# EAGLE design OneDollarBoard.com.1.004.r1 (EAGLE 9.7.0)
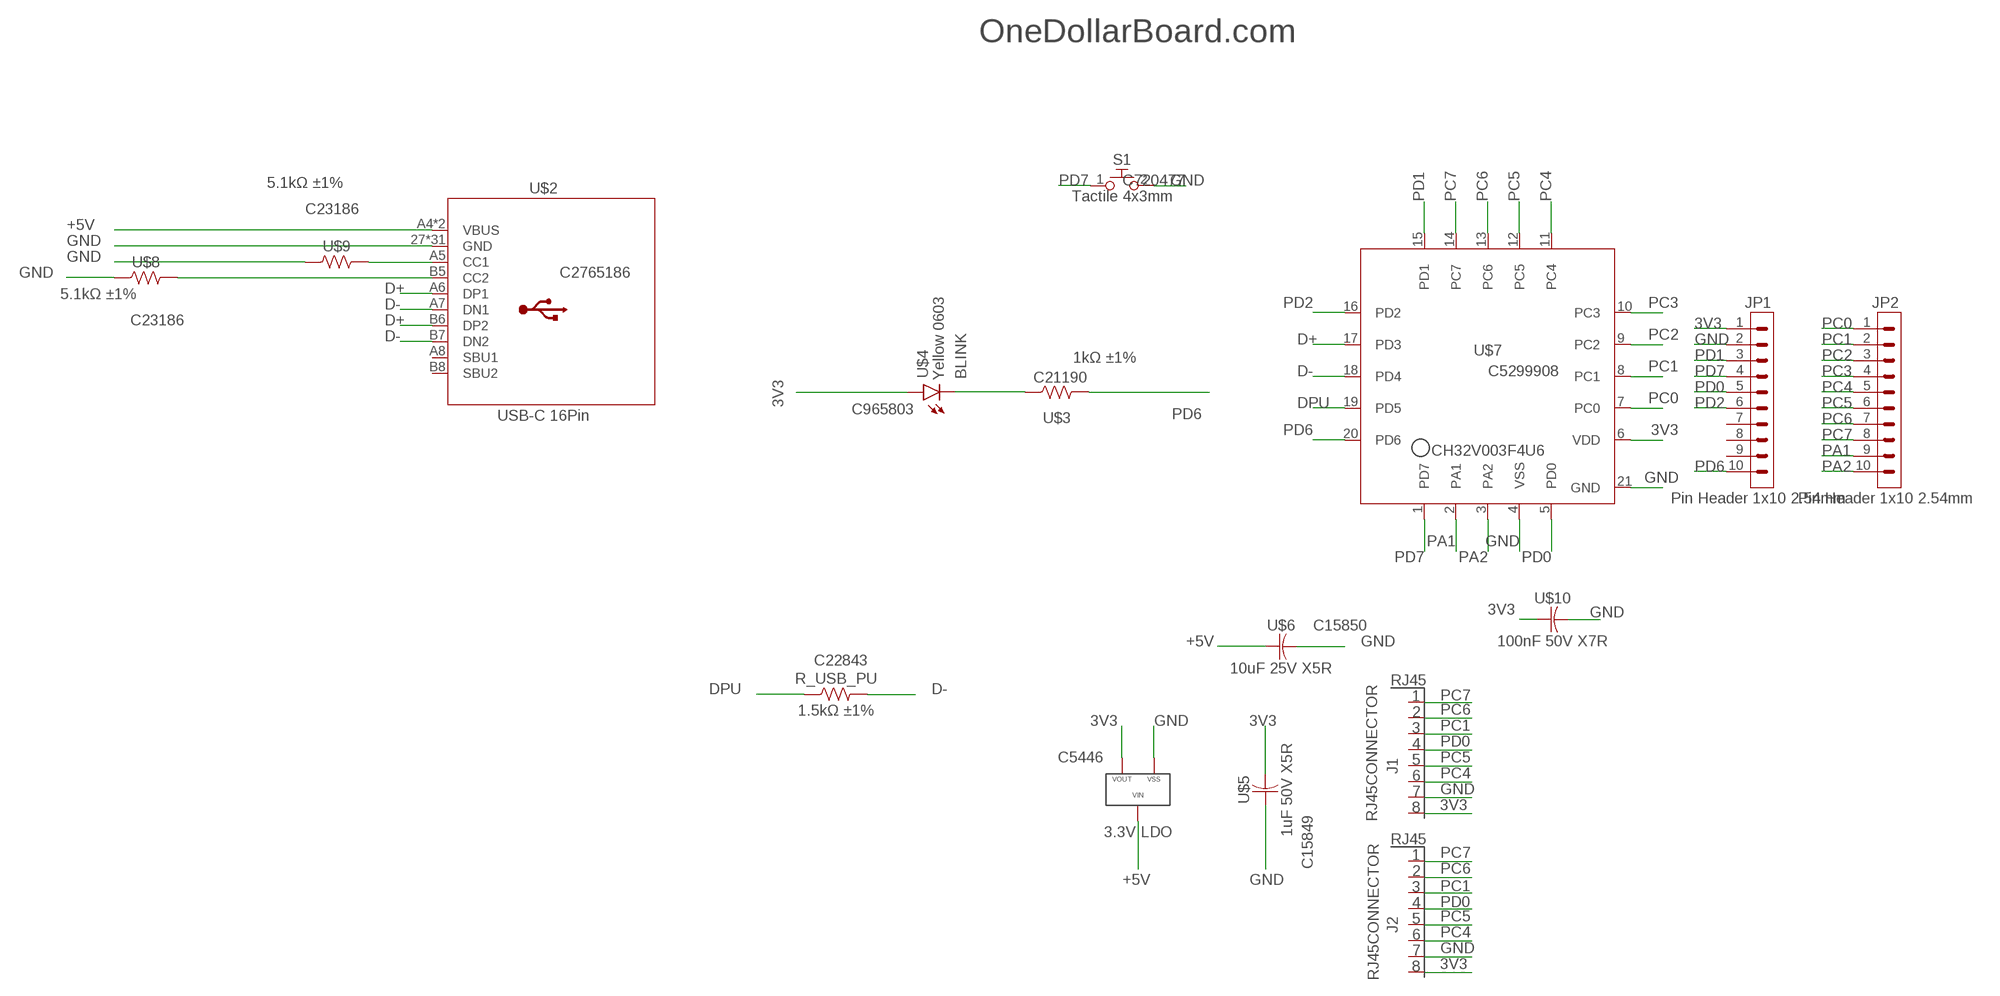
[diagram p0: schematic, sheet 1]

## Parts
J1  RJ45CONNECTOR  [2.54/1.0]
J2  RJ45CONNECTOR  [2.54/1.0]
JP1  Pin Header 1x10 2.54mm  PINHD-1X10  [1X10]
JP2  Pin Header 1x10 2.54mm  PINHD-1X10  [1X10]
R_USB_PU  1.5kΩ ±1%  R_0603_1.5K  [WRIS-RSKS_0603_WAVE]
S1  Tactile 4x3mm  B3U-X000B3U-1000P(M)1000P(M)  [B3U-1000P(M)]
U$1  3.3V LDO  XC6206P332MR-G  [XC6206P332MR-G]
U$2  USB-C 16Pin  USB-C  [CONN_TYPE-C-16P]
U$3  1kΩ ±1%  R_0603_1K_1%_0.1W_C21190  [RESC2208X45]
U$4  Yellow 0603  LED  [LEDC1507X40]
U$5  1uF 50V X5R  CAP1UF  [CPA1UF]
U$6  10uF 25V X5R  CAP10UF  [CAP0603]
U$7  CH32V003F4U6  CH32V003  [CH32V003F4U6]
U$8  5.1kΩ ±1%  R_0603_5.1KRES_0603  [WRIS-RSKS_0603_REFLOW]
U$9  5.1kΩ ±1%  R_0603_5.1KRES_0603  [WRIS-RSKS_0603_REFLOW]
U$10  100nF 50V X7R  CAP100NF  [CAP0603]

## Nets
3V3: J1.P$1(P1) J2.P$1(P1) JP1.1 U$1.2 U$4.A U$5.2 U$7.6(VDD) U$10.1
+5V: U$1.3 U$2.A4(VBUS) U$2.B4(VBUS) U$6.1
BLINK: U$3.1 U$4.C
D+: U$2.A6(DP1) U$2.B6(DP2) U$7.17(PD3)
D-: R_USB_PU.2 U$2.A7(DN1) U$2.B7(DN2) U$7.18(PD4)
DPU: R_USB_PU.1 U$7.19(PD5)
GND: J1.P$2(P2) J2.P$2(P2) JP1.2 S1.2 U$1.1 U$2.27(GND) U$2.28(GND) U$2.29(GND) U$2.30(GND) U$2.A1(GND) U$2.B1(GND) U$2.S_1(GND) U$2.S_1_H1(GND) U$2.S_1_H2(GND) U$2.S_2(GND) U$2.S_2_H1(GND) U$2.S_2_H2(GND) U$2.S_2_H3(GND) U$2.S_2_H4(GND) U$2.S_2_H5(GND) U$2.S_2_H6(GND) U$2.S_2_H7(GND) U$2.S_2_H12(GND) U$2.S_2_H13(GND) U$2.S_3(GND) U$2.S_3_H1(GND) U$2.S_3_H2(GND) U$2.S_3_H3(GND) U$2.S_3_H4(GND) U$2.S_3_H5(GND) U$2.S_4(GND) U$2.S_4_H1(GND) U$2.S_4_H2(GND) U$2.S_4_H3(GND) U$2.S_4_H4(GND) U$2.S_4_H5(GND) U$5.1 U$6.2 U$7.4(VSS) U$7.21(GND) U$8.1 U$9.1 U$10.2
N$1: U$2.A5(CC1) U$9.2
N$2: U$2.B5(CC2) U$8.2
PA1: JP2.9 U$7.2(PA1)
PA2: JP2.10 U$7.3(PA2)
PC0: JP2.1 U$7.7(PC0)
PC1: J1.P$6(P6) J2.P$6(P6) JP2.2 U$7.8(PC1)
PC2: JP2.3 U$7.9(PC2)
PC3: JP2.4 U$7.10(PC3)
PC4: J1.P$3(P3) J2.P$3(P3) JP2.5 U$7.11(PC4)
PC5: J1.P$4(P4) J2.P$4(P4) JP2.6 U$7.12(PC5)
PC6: J1.P$7(P7) J2.P$7(P7) JP2.7 U$7.13(PC6)
PC7: J1.P$8(P8) J2.P$8(P8) JP2.8 U$7.14(PC7)
PD0: J1.P$5(P5) J2.P$5(P5) JP1.5 U$7.5(PD0)
PD1: JP1.3 U$7.15(PD1)
PD2: JP1.6 U$7.16(PD2)
PD6: JP1.10 U$3.2 U$7.20(PD6)
PD7: JP1.4 S1.1 U$7.1(PD7)
Unconnected: JP1.7 JP1.8 JP1.9 U$2.A8(SBU1) U$2.B8(SBU2)

## Notes on the sheet
- OneDollarBoard.com

## Library data of the parts
J1 J2 = odb.1.004:RJ45CONNECTOR: Through-Hole Pad; CATEGORY: Connectors; DESCRIPTION: Pad with 2.54 mm diamater and 1mm drill; PACKAGE_SIZE: NA; PACKAGE_TYPE: Through Hole; PITCH: NA
JP1 JP2 = odb.1.004:PINHD-1X10: 8 C350306; CATEGORY: Connector, Pin Header; DATASHEET: https://www.lcsc.com/datasheet/C350306.pdf; DESCRIPTION: Header-Straight-10 Position; IPN: 8; LCSC: C350306; LCSC_PART: C350306; MANUFACTURER: HOAUC; MFR_PART: 2685Y-110CNG1SNA01; ODB_REV: 1.004.R1; PACKAGE: TH_1X10_2.54MM; PACKAGE_TYPE: Through Hole; PITCH: 0.100" (2.54mm); SUBCATEGORY: Headers; TYPE: Male Pins
R_USB_PU = odb.1.004:R_0603_1.5K: 9 C22843; CATEGORY: Resistor; DATASHEET: https://www.lcsc.com/datasheet/C22843.pdf; IPN: 9; LCSC: C22843; LCSC_PART: C22843; MANUFACTURER: UNI-ROYAL; MFR_PART: 0603WAF1501T5E; ODB_REV: 1.004; PACKAGE: 0603
S1 = odb.1.004:B3U-X000: Ultra-small Tactile Switch Contact form : SPST-NO Reference: Datasheet <https://omronfs.omron.com/en_US/ecb/products/pdf/en-b3u.pdf>; CATEGORY: Switch; DATASHEET: https://www.lcsc.com/datasheet/C720477.pdf; DESCRIPTION: Tactile Switch SPST-NO Top Actuated Surface Mount; LCSC: C720477; LCSC_PART: C720477; MANUFACTURER: XUNPU; MFR_PART: TS-1088-AR02016; MPN: B3U-1000PM; ODB_REV: 1.004; OPERATING_TEMPERATURE: -25°C ~ 70°C; PACKAGE: SMD; PACKAGE_SIZE: NA; PACKAGE_TYPE: SMD; PART_STATUS: ACTIVE; ROHS: COMPLIANT; SERIES: B3U; SUBCATEGORY: Tactile Switches; TYPE: SPST-NO
U$1 = odb.1.004:XC6206P332MR-G: 12 C5446; CATEGORY: Voltage Regulator; DATASHEET: https://www.lcsc.com/datasheet/C5446.pdf; IPN: 12; LCSC: C5446; LCSC_PART: C5446; MANUFACTURER: TOREX; MFR_PART: XC6206P332MR-G; ODB_REV: 1.004; PACKAGE: SOT-23-3
U$2 = odb.1.004:USB-C: 11 C2765186; CATEGORY: Connector; DATASHEET: https://www.lcsc.com/datasheet/C2765186.pdf; IPN: 11; LCSC: C2765186; LCSC_PART: C2765186; MANUFACTURER: SHOU HAN; MFR_PART: TYPE-C_16PIN_2MD(073); ODB_REV: 1.004; PACKAGE: SMD
U$3 = odb.1.004:R_0603_1K_1%_0.1W_C21190: 10 C21190; CATEGORY: Resistor; DATASHEET: https://www.lcsc.com/datasheet/C21190.pdf; IPN: 10; LCSC: C21190; LCSC_PART: C21190; MANUFACTURER: UNI-ROYAL; MFR_PART: 0603WAF1001T5E; ODB_REV: 1.004; PACKAGE: 0603
U$4 = odb.1.004:LED: IPN: 7 LCSC: C965803; CATEGORY: LED; DATASHEET: https://www.lcsc.com/datasheet/C965803.pdf; IPN: 7; LCSC: C965803; LCSC_PART: C965803; MANUFACTURER: XINGLIGHT; MFR_PART: XL-1608UYC-04; ODB_REV: 1.004; PACKAGE: 0603
U$5 = odb.1.004:CAP1UF: 5 C15849; CATEGORY: Capacitor; DATASHEET: https://www.lcsc.com/datasheet/C15849.pdf; IPN: 5; LCSC: C15849; LCSC_PART: C15849; MANUFACTURER: Samsung Electro-Mechanics; MFR_PART: CL10A105KB8NNNC; ODB_REV: 1.004; PACKAGE: 0603
U$6 = odb.1.004:CAP10UF: 4 C15850; CATEGORY: Capacitor; DATASHEET: https://www.lcsc.com/datasheet/C15850.pdf; IPN: 4; LCSC: C15850; LCSC_PART: C15850; MANUFACTURER: Samsung Electro-Mechanics; MFR_PART: CL21A106KAYNNNE; ODB_REV: 1.004; PACKAGE: 0805
U$7 = odb.1.004:CH32V003: 6 C5299908; CATEGORY: MCU; DATASHEET: https://www.lcsc.com/datasheet/C5299908.pdf; IPN: 6; LCSC: C5299908; LCSC_PART: C5299908; MANUFACTURER: WCH; MFR_PART: CH32V003F4U6; ODB_REV: 1.004; PACKAGE: QFN20 3x3mm
U$8 U$9 = odb.1.004:R_0603_5.1K: Resistor 5.1kΩ ±1% 100mW; CATEGORY: Resistor; DATASHEET: https://www.lcsc.com/datasheet/C23186.pdf; LCSC: C23186; LCSC_PART: C23186; MANUFACTURER: UNI-ROYAL; MFR_PART: 0603WAF5101T5E; ODB_REV: 1.004; PACKAGE: 0603
U$10 = odb.1.004:CAP100NF: 3 C30926; CATEGORY: Capacitor; DATASHEET: https://www.lcsc.com/datasheet/C30926.pdf; IPN: 3; LCSC_PART: C30926; MANUFACTURER: FH; MFR_PART: 0603B104K500NT; ODB_REV: 1.004; PACKAGE: 0603

## Board
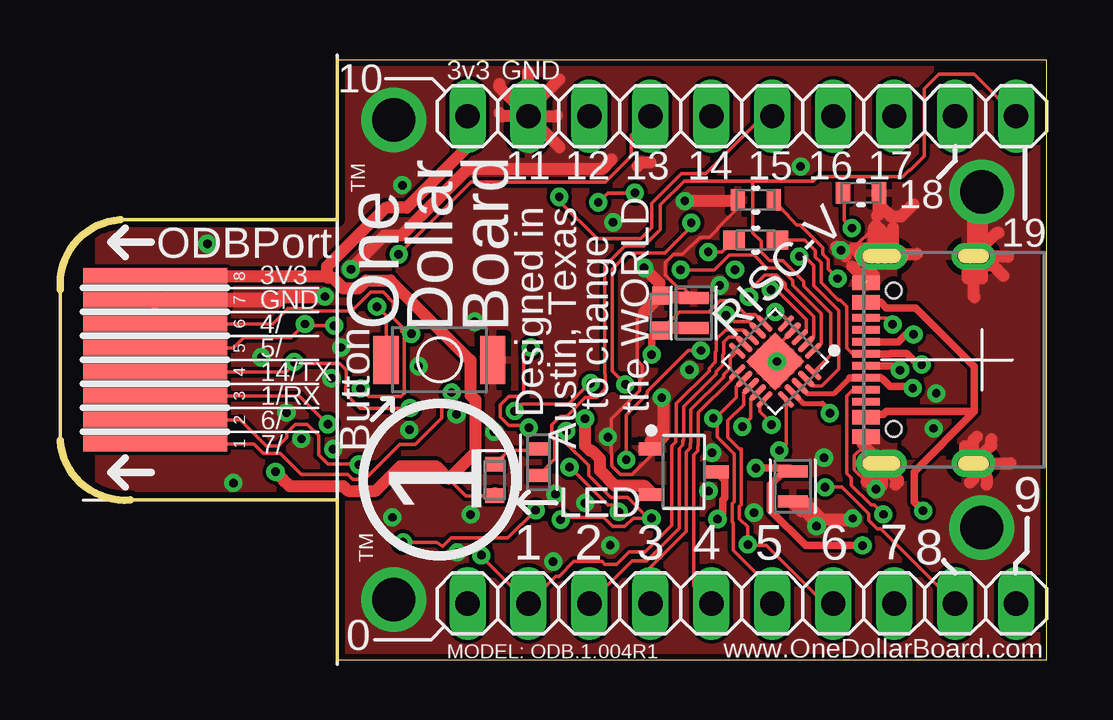
[diagram p1: board, top side]
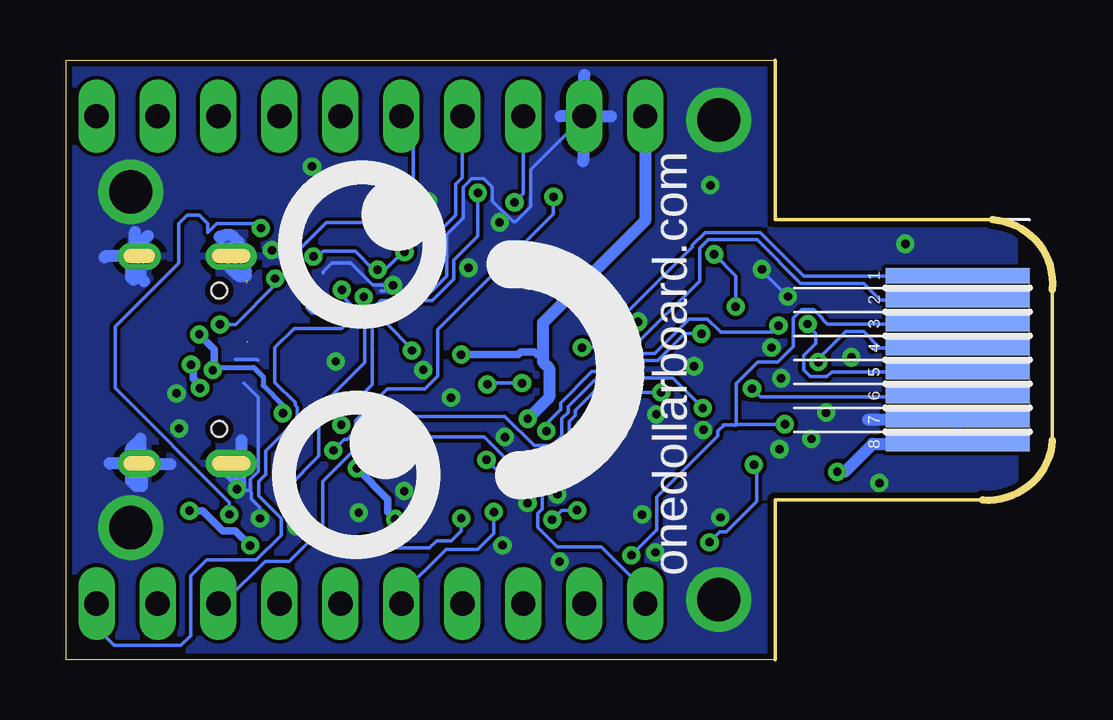
[diagram p2: board, bottom side, seen from below]

Size 41.11 x 25 mm. Coordinates in mm from the lower left corner, seen from the top.
Outline: 11.56,0 41.11,0 41.11,25 11.56,25 11.56,18.34 2.5,18.34 arc91 0.01,15.44 0.01,9.14 arc91 2.92,6.66 11.56,6.66 11.56,0
Copper layers (1*16): Top 0.035mm / dielectric 1.5mm / Bottom 0.035mm
Design rules "Fusion Electronics Design Rules *": minimum track width 6mil, minimum drill 0.35mm, track to track 6mil, track to pad 6mil, pad to pad 6mil, via to via 6mil, smd to smd 6mil, copper to edge 0.25mm, drill to drill 6mil, minimum pad ring 10mil, minimum via ring 8mil, stop-mask expansion 4mil, vias tented up to drill 0.5mm, thermal gap 10mil

### Footprints (pad centres in the part's own frame; a part is rotated, then mirrored left to right if it is on the bottom)
2.54/1.0 = smd 6 x 0.635: P$1 0,-3.5; P$2 0,-2.5; P$3 0,-1.5; P$4 0,-0.5; P$5 0,0.5; P$6 0,1.5; P$7 0,2.5; P$8 0,3.5
1X10 = drill 1.016 long: 1 -11.43,0; 2 -8.89,0; 3 -6.35,0; 4 -3.81,0; 5 -1.27,0; 6 1.27,0; 7 3.81,0; 8 6.35,0; 9 8.89,0; 10 11.43,0
WRIS-RSKS_0603_WAVE = smd 0.9 x 0.8: 1 -0.9,0; 2 0.9,0
B3U-1000P(M) = smd 1.05 x 2: 1 -2.225,0; 2 2.225,0
XC6206P332MR-G = smd 1.032 x 0.537: 1 -1.35,0.95; 2 -1.35,-0.95; 3 1.35,0
CONN_TYPE-C-16P = smd 1.016 x 2.1: 27 -4.32,4.18; 28 4.32,4.18; S_2 -4.32,4.18 | smd 1.016 x 1.8: 29 -4.32,0.35; 30 4.32,0.35; S_3 4.32,0.35; S_4 -4.32,0.35 | smd 0.6 x 1.14: A1 -3.2,4.826; A4 -2.4,4.826; B1 3.2,4.826; B4 2.4,4.826 | smd 0.3 x 1.14: A5 -1.25,4.826; A6 -0.25,4.826; A7 0.25,4.826; B7 -0.75,4.826; B8 -1.75,4.826 | smd 0.305 x 1.14: A8 1.25,4.826; B5 1.75,4.826; B6 0.75,4.826 | smd 1.016 x 2.2: S_1 4.32,4.18 | drill 0.6 pad 0.6: S_1_H1 -4.32,3.686; S_1_H2 -4.32,4.68; S_2_H1 4.32,3.68; S_2_H2 4.32,4.68; S_2_H3 -4.32,3.88; S_2_H4 -4.32,4.38; S_2_H5 4.32,4.18; S_2_H6 -4.32,3.68; S_2_H7 -4.32,4.08; S_2_H12 4.32,3.88; S_2_H13 4.32,4.48; S_3_H1 -4.32,0.7; S_3_H2 -4.32,0; S_3_H3 -4.32,0.4; S_3_H4 -4.32,0.2; S_3_H5 -4.32,0.6; S_4_H1 4.32,0.7; S_4_H2 4.32,0; S_4_H3 4.32,0.4; S_4_H4 4.32,0.2; S_4_H5 4.32,0.6 | hole 0.65: -2.89,3.68; 2.89,3.68
RESC2208X45 = smd 0.55 x 0.9: 1 -0.55,0; 2 0.55,0
LEDC1507X40 = smd 0.61 x 0.8: A 0.655,0; C -0.655,0
CPA1UF = smd 0.75 x 0.7: 1 -0.725,0; 2 0.725,0
CAP0603 = smd 0.5 x 1.25: 1 -0.625,0; 2 0.625,0
CH32V003F4U6 = smd 0.862 x 0.224: 1 -1.435,0.8; 2 -1.435,0.4; 3 -1.435,0; 4 -1.435,-0.4; 5 -1.435,-0.8; 11 1.435,-0.8; 12 1.435,-0.4; 13 1.435,0; 14 1.435,0.4; 15 1.435,0.8 | smd 0.224 x 0.862: 6 -0.8,-1.435; 7 -0.4,-1.435; 8 0,-1.435; 9 0.4,-1.435; 10 0.8,-1.435; 16 0.8,1.435; 17 0.4,1.435; 18 0,1.435; 19 -0.4,1.435; 20 -0.8,1.435 | smd 1.7 x 1.7: 21 0,0
WRIS-RSKS_0603_REFLOW = smd 0.6 x 0.9: 1 -0.75,0; 2 0.75,0

### Placement (x,y rotation side)
J1  3.96,12.5 180 top
J2  3.96,12.5 0 bottom
JP1  28.41,22.66 0 top
JP2  28.41,2.34 0 top
R_USB_PU  28.99,17.5 0 top
S1  15.81,12.5 0 top
U$1  25.99,7.83 0 top
U$2  38.41,12.5 90 top
U$3  19.94,8.23 270 top
U$4  18.12,7.49 270 top
U$5  25.02,14.45 270 top
U$6  30.53,7.23 270 top
U$7  29.8,12.43 225 top
U$8  28.99,19.17 0 top
U$9  33.37,19.46 180 top
U$10  26.41,14.45 90 top

### Tracks (layer width: path | path; a pad name or v marks a point on that pad's centre or on a via)
3V3  (via drill 0.35)
  Top 0.152: 4.31,16 4.46,15.95 4.41,16 J1.P$1 | U$5.2 25.06,13.72 25.16,13.82 | U$1.2 24.6,7.01 | U$5.2 24.9,13.72 | JP1.1 16.98,21.82 | U$4.A 16.9,6.83 16.2,7.54 | U$5.2 25.79,14.5 27.04,14.5 27.5,14.96 28.01,14.96 28.58,14.4 28.97,14.4 U$7.6 | 26.73,13.72 26.52,13.72 U$10.1
  Top 0.305: 11.12,15.96 11.13,15.95 | 24.9,13.72 24.65,13.47 v24.65,12.72 | 9.23,7.58 9.27,7.54 | 22.15,8.72 22.08,8.72 | 21.78,10.08 21.84,10.08 v21.87,10.04
  Top 0.508: 4.31,16 11.08,16 11.13,15.95 11.16,15.92 11.36,15.92 11.79,15.49 12.44,15.49 12.76,15.81 13.77,15.81 17.1,12.47 17.1,11.03 17.31,10.83 17.31,8.64 16.2,7.54 16.19,7.54 15.65,8.07 14.2,8.07 13.17,7.04 12,7.04 11.8,7.24 9.57,7.24 9.27,7.54 | JP1.1 16.98,21.93 | v8.98,7.83 9.23,7.58 | 22.15,8.72 22.5,8.36 22.5,7.88 23.14,7.24 24.37,7.24 24.6,7.01 | 18.12,6.93 U$4.A | 21.78,10.08 21.78,9.96 21.88,9.86 21.88,8.92 22.08,8.72 | 16.98,21.82 16.98,21.39 14.44,18.85 13.58,18.85 11.12,16.39 11.12,15.96 | U$10.1 25.16,13.82
  Bottom 0.152: JP1.1 16.98,22.56 | v8.98,7.83 8.67,7.83
  Bottom 0.305: 21.25,12.72 21.48,12.72 21.6,12.83 22.16,12.83 22.28,12.72 v24.65,12.72
  Bottom 0.508: 16.98,22.56 16.98,18.3 21.25,14.04 21.25,12.72 21.25,12.42 20.98,12.15 20.98,10.93 v21.87,10.04 | 8.67,7.83 7.5,9 J2.P$1
+5V  (via drill 0.35)
  Top 0.152: U$2.A4 33.59,10.21 | 34.08,14.9 U$2.B4
  Top 0.305: 38.09,10.34 34.43,10.34 34.3,10.21 33.59,10.21 | 38.09,10.34 38.09,12.22 35.65,14.66 35.36,14.66 34.43,14.66 34.19,14.9 34.08,14.9 | v35.97,6.2 35.59,6.58 35.59,7.84 38.09,10.34 | v29,7.99 30.4,7.99 U$6.1 30.17,7.86 29.6,7.28 29.6,6.23 31.07,4.76 v33.44,4.76 | U$1.3 27.7,7.47 27.7,6.74 27.62,6.67 27.62,6.08 v27.4,5.86
  Bottom 0.305: v33.44,4.76 34.06,5.37 34.59,5.37 35.42,6.2 v35.97,6.2 | v29,7.99 27.7,6.69 27.7,6.16 v27.4,5.86
BLINK
  Top 0.152: U$3.1 19.91,8.73 | 19.91,8.73 19.88,8.69 | U$4.C 18.71,8.73 19.91,8.73
D+  (via drill 0.35)  (1 unrouted)
  Top 0.152: U$7.17 30.53,11.12 | 31.77,10.68 31.78,10.67
  Top 0.203: 31.77,10.68 30.97,10.68 30.53,11.12 | 31.78,10.67 32.08,10.37 v32.08,10.27
  Top 0.305: U$2.A6 34.7,12.25 34.88,12.07 v35,12.07 | v35.56,13.56 35.24,13.56 34.93,13.25 33.55,13.25
  Bottom 0.152: 34.88,12.19 34.93,12.14 | v32.08,10.27 32.08,10.37
  Bottom 0.203: 34.88,12.19 33.3,12.19 32.9,11.79 32.9,11.42 32.08,10.6 32.08,10.37
  Bottom 0.305: v35,12.07 34.93,12.14 34.93,12.93 v35.56,13.56
D-  (via drill 0.35)
  Top 0.152: 33.64,11.69 U$2.B7 33.59,11.74 34.05,11.74 34.19,11.77 | 29.83,17.52 R_USB_PU.2 31.03,17.5 31.48,17.05 31.48,16.79 31.71,16.55 31.71,15.72 32.43,15 32.51,15 32.78,14.72 32.78,13 33.04,12.75 33.81,12.75
  Top 0.2: 31.12,11.11 U$7.18
  Top 0.203: 31.12,11.11 31.15,11.09 32.24,11.09 32.9,11.75
  Top 0.305: 34.19,11.77 34.25,11.71 34.28,11.71 34.6,11.38 35.47,11.38 v35.53,11.32 | U$2.A7 33.81,12.75 34.59,12.75 34.59,12.76 35.28,12.76 35.74,12.3 v35.91,12.3 | U$2.B7 32.9,11.75
  Bottom 0.305: v35.53,11.32 35.53,11.44 35.8,11.72 35.8,12.2 v35.91,12.3
DPU  (via drill 0.35)
  Top 0.152: U$7.19 31.38,11.41 31.75,11.41 32.45,12.11 32.45,14.55 31.4,15.6 31.4,16.43 31.07,16.76 30.86,16.76 v30.81,16.81 | R_USB_PU.1 27.76,17.17 27.75,17.17 27.58,17 v27.01,17
  Bottom 0.152: 30.87,16.97 30.71,16.82 30.71,16.72 30.4,17.03 29.06,17.03 28.28,16.25 v28.13,16.25 | v27.01,17 27.09,17 27.94,16.14 28.05,16.25 v28.13,16.25 | v28.13,16.26 v28.13,16.25 | 30.87,16.97 30.87,17.08 30.85,17.1 | 30.87,16.97 30.87,16.88 v30.81,16.81
GND  (via drill 0.35, 1.8, 1.8 pad 0.1)  (1 unrouted)
  Top 0.152: 25.06,15.09 U$5.1 | 26.53,14.94 U$10.2 26,15.49 25.77,15.49 25.22,16.03 25.22,16.55 25.58,16.9 25.95,16.9 26.66,17.61 27.06,17.61 27.41,17.96 27.41,17.99 28.16,18.74 U$8.1 | 34.05,18.5 34.05,18.14 34.01,18.1 33.91,18 33.06,17.15 32.98,17.07 | 33.44,9 33.44,8.84 33.1,8.51 33.1,7.92 33.6,7.43 33.97,7.05 34.04,7.05 34.04,7.06 v33.99,7.11 | 32.34,17.03 32.34,17.21 | 24.34,14.49 24.04,14.2 24.04,12.47 24.25,12.26 24.25,11.76 24.16,11.66 24.16,11.22 22.97,10.03 22.97,8.59 22.99,8.57 22.99,8.08 23.34,7.72 23.84,7.72 24.62,8.5 24.62,8.78 | 31.41,5.83 32.66,5.83 | J1.P$2 4.59,15 | v29.87,12.43 30.49,12.43 30.59,12.53 | 30.6,12.53 30.59,12.53 | 33.38,16.02 33.38,15.92 33.58,15.72 U$2.B1 | 33.61,16.02 33.58,15.99 U$2.B1 | U$2.B1 33.9,16.02 | 27.19,15.61 27.52,15.28 27.52,15.27 | U$7.21 29.9,12.53 | 29.9,12.53 30.59,12.53 | U$7.4 29.9,13.1 29.9,12.53
  Top 0.508: JP1.2 18.45,22.66 18.31,22.8 | JP1.2 19.51,24.5 | JP1.2 20.67,22.66 20.71,22.7 | JP1.2 20.61,21.57 | JP1.2 18.31,23.87 18.31,24 | JP1.2 19.52,22.91 20.81,24.2 | U$2.A1 33.58,9.14 | 33.58,9.14 33.44,9 | 34.04,7.05 34.23,7.24 U$2.27 | U$2.27 34.23,8.06 33.6,7.43 | U$2.27 33.58,8.83 33.58,9.14 | 33.91,16.02 33.9,16.02 33.61,16.02 | U$2.S_2_H5 34.33,16.92 | 34.33,16.92 35.7,16.92 | 32.73,16.82 32.34,17.21 32.4,17.21 v32.54,17.07 | 24.62,8.78 24.62,9.16 25.04,9.58 25.04,9.18 U$1.1 25.17,9.31 25.17,10.83 v25.07,10.93 | U$10.2 26.39,15.09 25.06,15.09 | 24.34,14.49 U$5.1 24.98,15.22 24.98,15.7 v24.34,16.34 | JP1.2 20.82,21.36 | JP1.2 19.52,21.45 19.61,21.36 | 31.41,5.83 31.04,6.2 | 31.11,6.5 31.11,6.26 31.04,6.2 | U$6.2 31,6.61 31.11,6.5 | 31.11,6.5 31.77,5.83 32.66,5.83 32.7,5.79 32.93,5.79 v33.03,5.89 | U$2.30 38.06,18.35 38.11,18.4 38.41,18.1 38.41,17.62 | U$2.30 37.81,16.57 37.81,15.9 | U$2.30 38.41,16.47 38.41,15.9 | U$2.30 38.06,15.15 38.11,15.1 | U$2.S_2_H5 33.39,16.82 33.06,17.15 34.1,17.15 34.33,16.92 | U$2.S_2_H5 33.91,17.14 33.91,18 | U$2.29 38.81,8.93 38.81,9.2 | U$2.29 37.71,8.53 37.71,8.9 | U$2.29 38.06,9.15 38.21,9.3 | U$2.29 38.06,7.53 37.91,7.38 | U$2.29 38.61,7.63 38.61,7.3 | U$2.29 39.59,8.18 39.61,8.2 | U$2.27 34.91,7.5 34.91,7.4 34.81,7.3 | U$2.30 39.49,16.82 39.51,16.8 | U$2.S_2_H5 34.71,17.3 34.71,18 | U$2.S_2_H5 34.23,17.88 34.01,18.1 | 39.31,16 38.86,16.45 38.43,16.45 U$2.30 | U$2.30 39.04,17.8 39.11,17.8 | 34.05,18.5 34.12,18.57 U$9.1 34.17,19.41 34.17,18.95 34.63,18.49 35.06,18.49 35.56,18.99 | 33,16.4 33.38,16.02 | U$8.1 28.11,19.12 v26.03,19.12 | 22.98,20.85 22.59,20.46 16.99,20.46 14.21,17.68 13.52,17.68 v12.12,16.28
  Top 0.508: 24.6,20.73 24.22,20.73 24.06,20.57 | 31.04,6.2 30.87,6.2 30.49,6.58
  Top 0.61: 4.59,15 9.1,15 9.27,15.17 10.99,15.17 11.02,15.14 v11.04,15.14
  Bottom 0.152: 33.44,7.01 33.48,7.05 33.88,7.05 34.05,7.05 | 7.7,10 7.72,9.98 7.78,9.98 | 33.44,7.01 33.44,7.52 33.1,7.85 33.1,10.92 33.71,11.53 | J2.P$2 6.14,10 | JP1.2 21.75,20.43 21.75,18.88 22.38,18.26 22.48,18.26 23.35,19.12 23.35,19.71 23.7,20.07 24.21,20.07 24.56,19.71 24.56,18.41 25.25,17.72 25.25,16 25.86,15.4 27.8,15.4 | 33.11,12.49 33.14,12.49 33.16,12.52 34.07,12.52 | 27.8,15.4 27.83,15.4 27.85,15.38 28,15.38 | 27.8,15.4 27.59,15.61 27.19,15.61 | 31.83,16.21 31.83,16.37 v32.54,17.07 | 30.39,16.11 30.39,16.18 30.04,16.52 29.25,16.52 28.34,15.61 v27.49,15.61 | 33.61,16.2 33.61,15.82 | 33.44,7.01 33.39,6.97 33.39,6.71 33.03,6.34 v33.03,5.89 | v11.04,15.14 12.12,16.22 v12.12,16.28
  Bottom 0.305: JP1.2 19.57,22.61 | 18.4,22.66 18.37,22.69 | 19.52,24.38 19.55,24.41 | 20.52,22.66 20.54,22.64
  Bottom 0.508: 19.57,22.61 19.57,20.77 | JP1.2 18.4,22.66 | JP1.2 19.52,24.38 | JP1.2 20.52,22.66 | 34.37,17.18 U$2.S_2_H1 33.91,16 33.61,16 | 33.61,16.2 U$2.S_2_H5 | U$2.S_2_H6 34.05,7.5 34.05,7.05 v33.99,7.11 | U$2.S_2_H7 33.88,7.73 33.88,7.05 | U$2.S_2_H4 33.8,8.41 33.8,9.16 | U$2.S_3_H2 39.29,8.18 39.3,8.19 | 36.77,8.15 37.98,8.15 U$2.S_3_H3 38,9.21 38.41,8.8 U$2.S_3_H2 | U$2.S_3_H4 37.94,7.91 37.94,7.24 38.19,7.24 38.41,7.46 U$2.S_3_H2 | U$2.S_4_H2 38.24,16.99 38.24,17.83 | U$2.S_4_H2 38.41,15.94 38.31,15.84 | U$2.S_4_H2 39.48,16.82 39.52,16.78 | 37.7,17.68 38.01,17.37 U$2.S_4_H3 38.01,15.92 37.87,15.78 | U$2.S_2_H13 33.93,17.42 34.21,17.7 34.51,17.7 34.59,17.62 34.71,17.62 | 3.82,10 J2.P$2 | 6.14,10 7.7,10
  other vias: 13.91,2.5 36.51,11.1 13.91,22.5 36.4,9.64 6.14,17.34 13.85,5.93 20.64,6.9 20.55,4.09 7.22,7.36 8.39,12.61 27.02,7.03 27.17,8.63 38.41,5.5 17.11,6.05 16.55,4.47 31.52,5.57 38.41,19.5 26.23,12.08 31.83,8.42 17.28,14.08 22.83,9.28 22.93,4.77 21.88,6.53 18.09,9.5 14.94,12.23 14.55,9.58 16.52,10.23 11.72,13.02 14.26,19.78 23.05,18.23 9.44,10.3 11.38,8.78 11.32,11.73 10.06,9.2 28.92,6.13 30.86,20.56
  pour Top: 1.61,-0.85 41.56,-0.85 41.56,25.85 1.61,25.85
  pour Bottom: 1.55,-1.05 41.65,-1.05 41.66,-1.04 41.66,25.94 41.65,25.95 1.65,25.95
N$1  (via drill 0.35)
  Top 0.152: U$9.2 32.68,19.4 32.68,18.31 v33,17.99 | v34.31,6.06 33.92,6.45 33.8,6.45 32.97,7.27 32.97,7.58 32.78,7.76 32.78,11 33.04,11.25 U$2.A5
  Bottom 0.152: v34.31,6.06 34.31,6.56 39.07,11.32 39.07,13.89 36.42,16.54 36.42,18.19 36.06,18.54 35.56,18.54 35.2,18.19 35.2,17.81 34.83,18.18 33.18,18.18 32.99,17.99 | 32.99,17.99 32.95,17.95 | 32.99,17.99 v33,17.99
N$2  (via drill 0.35)
  Top 0.152: U$8.2 30.7,18.13 30.83,18.13 31.79,17.17 31.79,16.91 32.01,16.68 32.01,16.28 v32.4,15.89 | U$2.B5 34.42,14.25 v34.7,13.98
  Bottom 0.152: v32.4,15.89 32.4,15.63 34.05,13.98 v34.7,13.98 | v34.7,13.98
PA1  (via drill 0.35)
  Top 0.152: JP2.9 34.19,5.45 34.06,5.45 33.7,5.81 33.7,6.08 32.58,7.2 31.9,7.2 v31.88,7.18 | U$7.2 31.12,13.16 31.41,13.45 31.41,14.3 30.22,15.48 30.22,15.67 29.87,16.03 29.37,16.03 28.77,15.43 28.77,15.18 v28.71,15.12
  Bottom 0.152: v28.71,15.12 28.71,15.07 28.67,15.02 28.67,12.39 30.58,10.48 30.58,8.48 v31.88,7.18
PA2  (via drill 0.35)
  Top 0.152: U$7.3 31.1,13.73 31.1,14.18 29.91,15.37 29.67,15.37 v29.62,15.42
  Bottom 0.152: JP2.10 39.84,1.33 39.11,0.6 37.72,0.6 37.71,0.59 36.32,0.59 35.91,1 35.91,3.5 35.26,4.15 33.19,4.15 32.15,5.19 32.15,5.9 33.09,6.83 33.09,7.44 32.8,7.73 32.8,8.69 31.47,10.02 31.47,10.52 31.57,10.62 31.57,10.72 32.41,11.56 32.41,13.01 31.61,13.81 29.63,13.81 29.19,14.24 29.19,14.75 29.62,15.17 v29.62,15.42
PC0  (via drill 0.35)
  Top 0.152: U$7.7 28.71,14.09 28.08,14.09 27.81,14.36 v27.75,14.36 | v26.7,12.89 26.18,12.89 25.62,12.33 24.47,11.18 24.47,11.07 23.59,10.2 v23.59,8.33
  Bottom 0.152: JP2.1 16.98,2.86 18.82,4.7 20.65,4.7 21.47,5.51 21.47,6.09 21.28,6.28 21.28,6.78 22.47,7.97 23.24,7.97 v23.59,8.33 | v26.7,12.89 26.7,12.96 27.75,14.01 v27.75,14.36
PC1  (via drill 0.35)
  Top 0.152: J1.P$6 7.09,11 9.98,11 v11.16,9.82 | v17.56,4.35 17.56,4.3 JP2.2 20.66,3.48 20.8,3.48 21.41,4.09 22.59,4.09 22.71,3.97 23.21,3.97 23.72,4.48 24.38,4.48 25.49,5.59 25.49,8.92 25.65,9.08 25.65,9.26 25.68,9.29 25.68,10.68 27.05,12.04 27.05,12.15 27.31,12.41 27.31,12.83 27.35,12.87 27.35,13.37 27.73,13.75 28.48,13.75 U$7.8
  Bottom 0.152: J2.P$6 9.4,14 9.6,14.2 9.6,14.25 9.96,14.6 10.46,14.6 10.82,14.25 10.82,13.06 11.46,12.41 12.28,12.41 13.18,11.51 13.18,9.78 13.24,9.78 | v17.56,4.35 16.5,5.41 16.5,6.78 13.95,9.33 13.95,9.53 13.7,9.78 | 13.72,9.78 13.7,9.78 | 13.7,9.78 13.24,9.78 | 13.24,9.78 13.23,9.76 13.21,9.76 13.16,9.82 v11.16,9.82
PC2
  Top 0.152: JP2.3 23.85,4.13 24.46,4.13 25.79,5.46 25.79,8.79 25.95,8.96 25.95,9.13 25.99,9.16 25.99,10.55 27.35,11.92 27.35,12.02 27.61,12.29 27.61,12.7 27.66,12.74 27.66,13.24 27.86,13.45 28.24,13.45 28.51,13.18 U$7.9
PC3  (1 unrouted)
  Top 0.152: JP2.4 24.6,3.84 26.1,5.34 26.1,8.67 26.26,8.83 26.26,9.01 26.29,9.04 26.29,10.43 27.66,11.79 27.66,11.9 27.92,12.16 27.92,12.57 U$7.10
PC4  (via drill 0.35)  (1 unrouted)
  Top 0.152: JP2.5 26.4,3.08 26.4,8.54 26.56,8.7 26.56,8.88 26.6,8.91 26.6,10.3 27.96,11.66 27.96,11.72 U$7.11 | 14.25,13.89 14.55,13.59 v14.64,13.59 | J1.P$3 8.86,14 9.49,14.63 10.48,14.63 10.58,14.53 12.16,14.53 12.96,15.33 13.46,15.33 13.89,14.9 13.89,14.25 14.25,13.89 | v23.29,6.15 22.99,6.46 22.82,6.46 21.25,8.03 v21.23,8.03 | v12.53,11.3 12.86,10.97 14.2,10.97 14.34,11.11 14.34,13.6 14.25,13.69 14.25,13.89
  Bottom 0.152: JP2.5 27.14,2.74 25.28,4.6 23.96,4.6 23.29,5.27 v23.29,6.15 | v21.23,8.03 20.84,8.03 20.14,8.73 20.14,9.92 19.89,10.18 19.89,10.39 19.03,11.25 18.59,11.25 17.38,12.46 16.45,12.46 15.33,13.59 v14.64,13.59 | J2.P$3 4.01,10.95 12.17,10.95 v12.53,11.3
PC5  (via drill 0.35)
  Top 0.152: 4.46,13.15 4.5,13.19 4.7,13.19 4.51,13 J1.P$4 | 4.46,13.15 4.31,13 | J1.P$4 4.11,13.15 4.46,13.15 | J1.P$4 7.22,13 7.65,13.43 9.63,13.43 10.22,14.03 10.26,13.99 | 27.38,10.14 27.38,9.28 28.08,8.57 28.08,6.59 28.01,6.51 28.01,5.75 28.05,5.7 28.05,4.55 29.68,2.92 JP2.6 | 27.38,10.14 28.18,10.94 28.18,11.39 28.49,11.7 U$7.12 | 27.38,10.14 27.3,10.14 v27.23,10.06 v27.22,10.06 | 10.26,13.99 v10.21,13.99 | v11.42,13.93 10.33,13.93 10.26,13.99
  Bottom 0.152: J2.P$4 9.21,12 9.41,11.8 10.11,11.8 10.38,12.07 10.38,12.67 9.87,13.19 9.87,13.6 10.21,13.95 v10.21,13.99 | v27.22,10.06 27.23,10.07 27.23,10.09 27.28,10.14 22.83,10.14 21.61,8.93 20.85,8.93 20.45,9.32 20.45,10.05 20.19,10.3 20.19,10.55 19.1,11.64 18.63,11.64 17.5,12.77 16.58,12.77 15.15,14.2 14.38,14.2 13.84,13.65 11.69,13.65 v11.42,13.93
PC6  (via drill 0.35)
  Top 0.152: JP2.7 31.84,2.34 29.42,4.76 28.7,4.76 v28.66,4.8 28.66,5.53 28.31,5.88 28.31,6.38 28.39,6.46 28.39,8.7 | 28.39,8.7 28.39,8.78 | U$7.13 28.48,11.11 28.48,10.62 27.82,9.96 27.82,9.26 28.39,8.7 | v14.3,4.9 15.7,4.9 15.95,4.72 16.3,5.08 18.66,5.08 v19.82,6.23 | v20.86,5.84 20.95,5.92 22.13,5.92 22.14,5.92 22.66,5.92 23.04,5.55 23.54,5.55 23.89,5.9 v24.64,5.9 24.52,5.9 23.65,6.76 22.94,6.76 22.02,7.68 22.02,8.09 21.1,9.02 v21.1,9.53 | v12.45,8.13 12.43,8.15 11.15,8.15 10.78,8.53 10.78,9.34 10.31,9.81 9.81,9.81 9.45,9.45 9.45,9.27 9.1,8.91 8.59,8.91 7.5,10 J1.P$7
  Bottom 0.152: JP2.7 32.22,2.29 32.16,2.29 32.16,2.4 | v24.64,5.9 24.64,5.37 25.05,4.96 25.66,4.96 25.97,4.65 28.81,4.65 v28.66,4.8 | J2.P$7 7.18,15 7.87,15.69 10.49,15.69 12.31,17.51 14.36,17.51 14.72,17.15 14.72,15.79 17.43,13.07 17.63,13.07 18.7,12.01 19.2,12.01 20.5,10.71 20.5,10.43 20.99,9.93 20.99,9.63 v21.1,9.53 | v14.3,4.9 13.87,5.33 13.6,5.33 12.33,6.59 12.33,8.01 v12.45,8.13 | v20.86,5.84 20.47,6.23 v19.82,6.23
PC7  (via drill 0.35)
  Top 0.152: U$7.14 29.06,11.13 28.79,10.87 28.79,10.07 v28.43,9.71 | v19.62,13.01 19.31,12.71 19.31,11.11 19.18,10.97 18.69,10.97 18.34,10.62 18.34,10.11 18.69,9.76 19.45,9.76 v19.54,9.67 | v16.32,11.14 16.32,10.88 15.91,10.48 15.91,10.09 14.81,8.98 14.16,8.98 12.7,7.52 12.2,7.52 12,7.72 10.06,7.72 9.18,8.61 8.47,8.61 8.07,9 J1.P$8
  Bottom 0.152: JP2.8 34.66,2.44 34.47,2.44 32.82,4.09 31.82,4.09 30.41,5.5 30.41,7.43 29.37,8.47 28.57,9.27 | 19.71,9.63 19.71,9.44 19.72,9.43 19.72,8.68 20.98,7.42 21.48,7.42 22.41,8.35 22.75,8.35 23.69,9.29 28.55,9.29 28.57,9.27 | 19.71,9.63 19.71,9.64 19.68,9.67 v19.54,9.67 | v28.43,9.71 28.57,9.57 28.57,9.27 | v19.62,13.01 19.21,13.01 15.02,17.2 15.02,17.28 14.49,17.81 12.18,17.81 10.37,16 J2.P$8 | 19.71,9.63 19.59,9.76 18.69,9.76 17.31,11.14 v16.32,11.14
PD0  (via drill 0.35)
  Top 0.152: J1.P$5 9.43,12 9.77,12.33 | 9.77,12.33 9.77,12.34 11.65,12.34 11.92,12.07 11.92,11.39 11.91,11.37 11.91,11.07 12.51,10.46 14.21,10.46 14.24,10.49 v14.58,10.49 | U$7.5 30.25,14.23 29.99,14.49 v29.8,14.49 | v23.56,11.48 23,12.03 23,16.29 23.66,16.94 25.19,16.94 26.41,18.17 26.35,18.17 v26.3,18.21 | v22.12,11.53 22.07,11.53 21.21,10.67 19.25,10.67 v18.94,10.37 | v9.77,12.41 9.77,12.33
  Bottom 0.152: v23.56,11.48 23.5,11.53 v22.12,11.53 | J2.P$5 7.2,13 | 7.2,13 7.47,13 7.5,12.97 | 7.2,13 7.88,13.67 8.63,13.67 9.94,12.36 9.65,12.36 9.67,12.34 9.7,12.34 v9.77,12.41 | JP1.5 26.64,22.16 26.64,18.58 | 29.88,14.62 29.88,14.46 | 29.88,14.46 30.88,14.46 31.08,14.66 31.08,15.92 31.43,16.28 31.43,17.05 30.26,18.22 27,18.22 26.64,18.58 | 29.88,14.46 | 26.64,18.58 26.64,18.55 v26.3,18.21 | v18.94,10.37 17.56,11.74 15.84,11.74 v14.58,10.49 | v29.8,14.49 29.83,14.46 29.88,14.46
PD1  (via drill 0.35)
  Top 0.152: U$7.15 29.15,10.65 29.15,10.34 29.87,9.63 29.7,9.79 v29.64,9.79 | v23.95,19.46 22.82,19.46 v22.43,19.06
  Bottom 0.152: JP1.3 22.05,19.44 v22.43,19.06 | v23.95,19.46 23.95,17.65 24.95,16.66 24.95,15.88 25.86,14.96 28,14.96 28.36,14.61 28.36,11.47 29.64,10.18 v29.64,9.79
PD2  (via drill 0.35)
  Top 0.152: JP1.6 29.3,22.66 26.91,20.26 25.89,20.26 24.66,19.04 24.66,18.01 24.21,17.55 22.38,17.55 20.8,19.13 v20.8,19.29 | U$7.16 30.25,9 v29.98,8.72
  Bottom 0.152: v29.98,8.72 29.51,9.18 29.39,9.18 29.04,9.54 29.04,9.96 27.72,11.28 26.17,11.28 25.62,11.83 25.62,13.77 20.8,18.59 v20.8,19.29
PD6
  Top 0.152: U$7.20 32.11,12.71 32.11,14.46 31,15.57 31,15.76 30.12,16.64 29.57,16.64 29.21,17 29.21,17.44 28.87,17.79 28.87,19.92 28.87,19.96 | U$3.2 20.62,8.36 20.62,9.15 20.49,9.28 20.49,9.78 20.85,10.14 21.11,10.14 21.89,10.92 22.37,10.92 22.72,11.28 22.72,11.88 22.7,11.9 22.7,16.41 23.53,17.25 24.33,17.25 25.02,17.93 25.02,18.97 26.01,19.96 28.87,19.96 | 28.87,19.96 31.38,19.96 31.56,20.14 35.12,20.14 35.39,20.41 35.42,20.41 36.01,21 36.01,23.8 36.62,24.41 37.71,24.41 37.72,24.4 38.1,24.4 JP1.10
PD7  (via drill 0.35)
  Top 0.152: U$7.1 31.4,12.88 31.71,13.19 31.71,14.43 30.53,15.61 30.53,15.8 30,16.33 29.45,16.33 28.92,16.87 27.88,16.87 27.26,16.25 v25.87,16.25 v25.86,16.25 | S1.1 13.58,14.35 v13.21,14.72 | v14.11,16.9 17.11,19.9 22.71,19.9 23.81,21 23.81,21.87 JP1.4
  Bottom 0.152: v25.86,16.25 25.7,16.41 25.7,17.7 24.87,18.54 24.87,19.84 24.6,20.1 JP1.4 | v13.21,14.72 13.21,16 v14.11,16.9

### Text on the board
tPlace: 10 | 3v3 | GND | 11 | 12 | 13 | 14 | 15 | 16 | 17 | TM | Dollar | Board | 18 | One | the WORLD | RISC-V | Designed in | Austin, Texas | 19 | to change | ODBPort | 3V3 | GND | 4/ | Button | 5/ | 14/TX | 1/RX | 6/ | 7/ | 9 | TM | 1 | 1 | LED | 2 | 3 | 4 | 5 | 6 | 7 | 8 | 0 | MODEL: ODB.1.004R1 | www.OneDollarBoard.com
bPlace: onedollarboard.com